# EAGLE design ace128_pcf8574_smd_v3 (EAGLE 9.2.2)
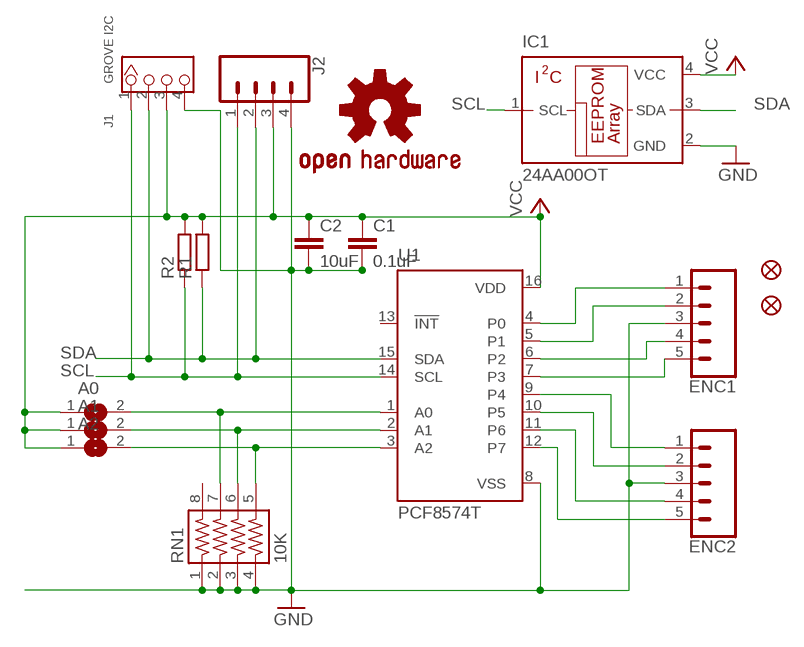
[diagram p0: schematic, sheet 1]

## Parts
A0  SJ  [SJ]
A1  SJ  [SJ]
A2  SJ  [SJ]
C1  0.1uF  C-EUC0603  [C0603]
C2  10uF  C-EUC0805  [C0805]
ENC1  CONN_05  [1X05]
ENC2  CONN_05  [1X05]
FD1  FIDUCIAL1X2  [FIDUCIAL-1X2]
FD2  FIDUCIAL1X2  [FIDUCIAL-1X2]
IC1  24AA00OT  [SOT23-5L]
J1  GROVE I2C  GROVE-CONNECTOR-DIP(4P-2.0)  [HW4-2.0]
J2  CONN_04  [1X04]
LOGO1  OSHW-LOGOS  [OSHW-LOGO-S]
R1  R-EU_0207/2V  [0207/2V]
R2  R-EU_0207/2V  [0207/2V]
RN1  10K  743-8  [743-8]
U1  PCF8574T  [SO16W]

## Nets
A0: A0.2 RN1.7 U1.1(A0)
A1: A1.2 RN1.6 U1.2(A1)
A2: A2.2 RN1.5 U1.3(A2)
GND: C1.2 C2.2 ENC1.3 ENC2.3 IC1.2(GND) J1.4 J2.4 RN1.1 RN1.2 RN1.3 RN1.4 U1.8(VSS)
P0: ENC1.1 U1.4(P0)
P1: ENC1.2 U1.5(P1)
P2: ENC1.4 U1.6(P2)
P3: ENC1.5 U1.7(P3)
P4: ENC2.1 U1.9(P4)
P5: ENC2.2 U1.10(P5)
P6: ENC2.4 U1.11(P6)
P7: ENC2.5 U1.12(P7)
SCL: IC1.1(SCL) J1.1 J2.1 R2.1 U1.14(SCL)
SDA: IC1.3(SDA) J1.2 J2.2 R1.1 U1.15(SDA)
VCC: A0.1 A1.1 A2.1 C1.1 C2.1 IC1.4(VCC) J1.3 J2.3 R1.2 R2.2 U1.16(VDD)
Unconnected: RN1.8 U1.13(!INT)

## Library data of the parts
A0 A1 A2 = jumper:SJ: SMD solder JUMPER
C1 C2 = rcl:C-EU: CAPACITOR, European symbol
ENC1 ENC2 = SparkFun-Connectors:CONN_05: Multi connection point. Often used as Generic Header-pin footprint for 0.1 inch spaced/style header connections On any of the 0.1 inch spaced packages, you can populate with these: Break Away Headers - Straight <https://www.sparkfun.com/products/116> (PRT-00116) Break Away Male Headers - Right Angle <https://www.sparkfun.com/products/553> (PRT-00553) Female Headers <https://www.sparkfun.com/products/115> (PRT-00115) Break Away Headers - Machine Pin <https://www.sparkfun.com/products/117> (PRT-00117) Break Away Female Headers - Swiss Machine Pin <https://www.sparkfun.com/products/743> (PRT-00743) For SCREWTERMINALS and SPRING TERMINALS visit here: Screw Terimnals on SparkFun.com <https://www.sparkfun.com/search/results?term=Screw+Terminals> (5mm/3.5mm/2.54mm spacing) This device is also useful as a general connection point to wire up your design to another part of your project. Our various solder wires solder well into these plated through hole pads. Hook-Up Wire - Assortment (Stranded, 22 AWG) <https://www.sparkfun.com/products/11375> (PRT-11375) Hook-Up Wire - Assortment (Solid Core, 22 AWG) <https://www.sparkfun.com/products/11367> (PRT-11367) View the entire wire category on our website here <https://www.sparkfun.com/categories/141> Special notes: Molex polarized connector foot print use with SKU : PRT-08231 with associated crimp pins and housings. 1MM SMD Version SKU: PRT-10208
FD1 FD2 = SparkFun-Aesthetics:FIDUCIAL: Fiducial Alignment Points Point-of-reference for pick-and-place machines and other optical instruments.
IC1 = microchip:24*00: Serial EEPROM 128 bit, I2C (AA = 1.8 V/LC = 2.5 V/C = 5.0 V); MF: MICROCHIP; MPN: 24AA00T-I/OTG; OC_FARNELL: 1331264; OC_NEWARK: 89H3038
J1 = Seeed-OPL-Connector:GROVE-CONNECTOR-DIP(4P-2.0): 320110033; VALUE: 4P-2.0
J2 = SparkFun-Connectors:CONN_04: Multi connection point. Often used as Generic Header-pin footprint for 0.1 inch spaced/style header connections On any of the 0.1 inch spaced packages, you can populate with these: Break Away Headers - Straight <https://www.sparkfun.com/products/116> (PRT-00116) Break Away Male Headers - Right Angle <https://www.sparkfun.com/products/553> (PRT-00553) Female Headers <https://www.sparkfun.com/products/115> (PRT-00115) Break Away Headers - Machine Pin <https://www.sparkfun.com/products/117> (PRT-00117) Break Away Female Headers - Swiss Machine Pin <https://www.sparkfun.com/products/743> (PRT-00743) For SCREWTERMINALS and SPRING TERMINALS visit here: Screw Terimnals on SparkFun.com <https://www.sparkfun.com/search/results?term=Screw+Terminals> (5mm/3.5mm/2.54mm spacing) This device is also useful as a general connection point to wire up your design to another part of your project. Our various solder wires solder well into these plated through hole pads. Hook-Up Wire - Assortment (Stranded, 22 AWG) <https://www.sparkfun.com/products/11375> (PRT-11375) Hook-Up Wire - Assortment (Solid Core, 22 AWG) <https://www.sparkfun.com/products/11367> (PRT-11367) View the entire wire category on our website here <https://www.sparkfun.com/categories/141> Special notes: Molex polarized connector foot print use with SKU : PRT-08231 with associated crimp pins and housings. 1MM SMD Version SKU: PRT-10208; PROD_ID: CONN-09696
LOGO1 = SparkFun-Aesthetics:OSHW-LOGO: Open-Source Hardware (OSHW) Logo This logo indicates the piece of hardware it is found on incorporates a OSHW license and/or adheres to the definition of open source hardware found here: http://freedomdefined.org/OSHW
R1 R2 = rcl:R-EU_: RESISTOR, European symbol
RN1 = resistor-array:743-8: CTS 743 Series 8 Terminations, 4 Resistors
U1 = micro-philips:PCF8574: I2C-Bus Remote 8-bit I/O expander http://www.semiconductors.philips.com/acrobat_download/datasheets/PCF8574_4.pdf; MPN: PCF8574T/3,512; OC_FARNELL: 1201255; OC_NEWARK: 70R6870

## Board
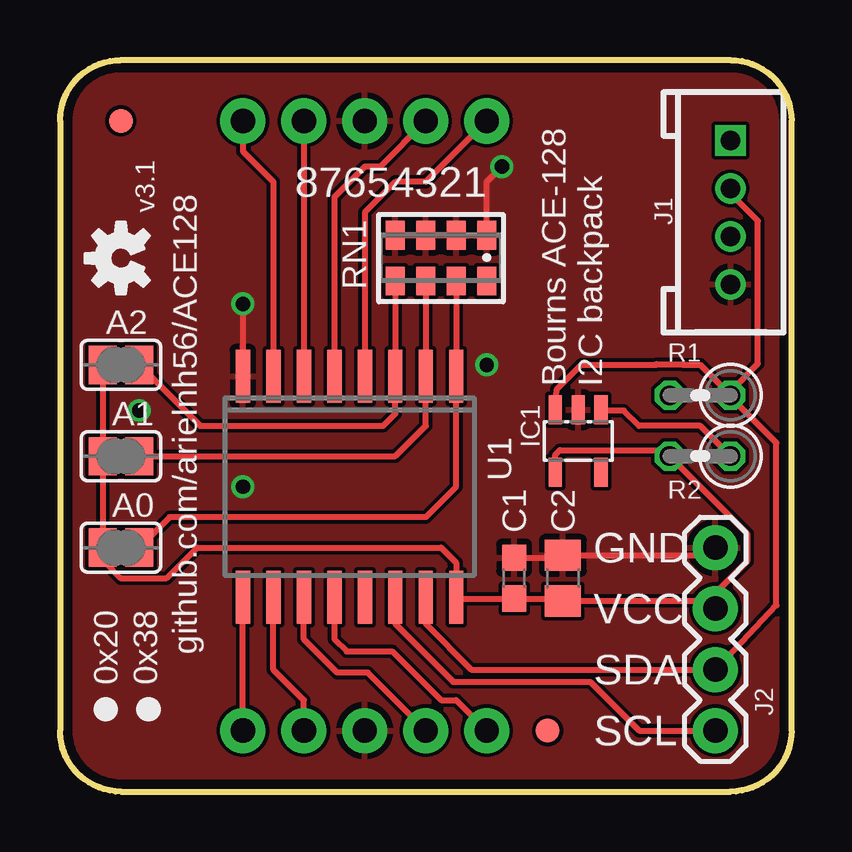
[diagram p1: board, top side]
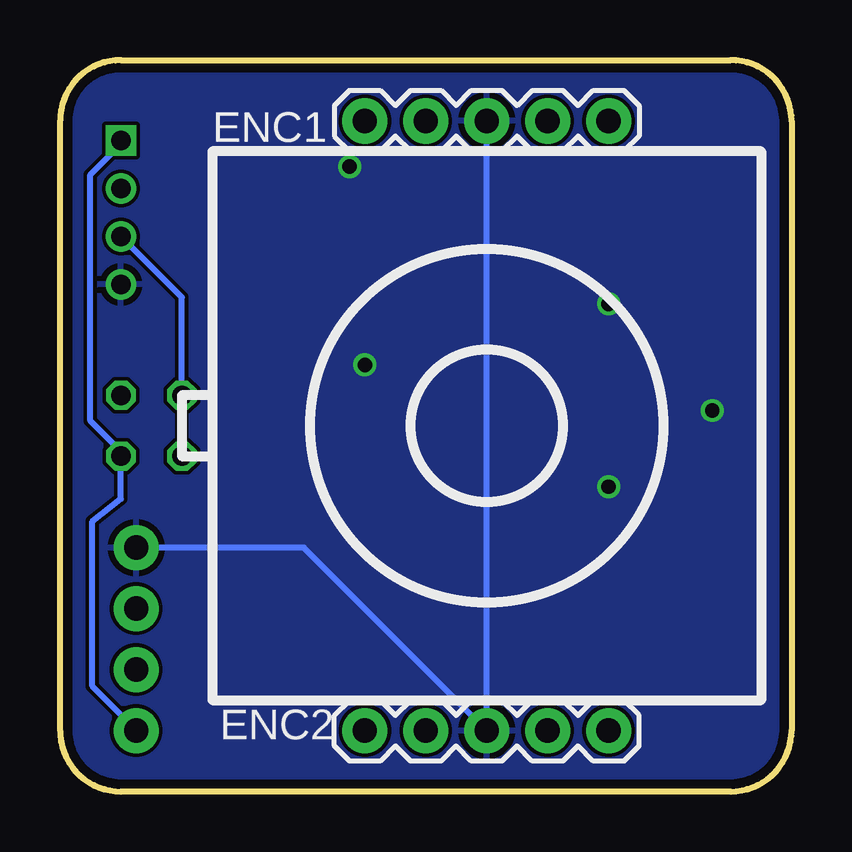
[diagram p2: board, bottom side, seen from below]

Size 30.48 x 30.48 mm. Coordinates in mm from the lower left corner, seen from the top.
Outline: 2.54,0 27.94,0 arc90 30.48,2.54 30.48,27.94 arc90 27.94,30.48 2.54,30.48 arc90 0,27.94 0,2.54 arc90 2.54,0
Copper layers (1*16): Top 0.0356mm / dielectric 1.5011mm / Bottom 0.0356mm
Design rules "mypcbway": minimum track width 6mil, minimum drill 13mil, track to track 6mil, track to pad 6mil, pad to pad 6mil, via to via 6mil, smd to smd 6mil, copper to edge 15mil, drill to drill 6mil, minimum pad ring 7mil, minimum via ring 7mil, stop-mask expansion 2.5mil, vias tented up to drill 24mil, thermal gap 10mil

### Footprints (pad centres in the part's own frame; a part is rotated, then mirrored left to right if it is on the bottom)
SJ = smd 1.168 x 1.6: 1 -0.762,0; 2 0.762,0
C0603 = smd 1.1 x 1: 1 -0.85,0; 2 0.85,0
C0805 = smd 1.3 x 1.5: 1 -0.95,0; 2 0.95,0
1X05 = drill 1.016 pad 1.88: 1 0,0; 2 2.54,0; 3 5.08,0; 4 7.62,0; 5 10.16,0
FIDUCIAL-1X2 = smd 1 x 1: 1 0,0
SOT23-5L = smd 0.55 x 1.2: 1 -0.95,-1.3; 2 0,-1.3; 3 0.95,-1.3; 4 0.95,1.3; 5 -0.95,1.3
HW4-2.0 = drill 0.8 pad 1.27 square: 1 -3,0 | drill 0.8 pad 1.27: 2 -1,0; 3 1,0; 4 3,0
1X04 = drill 1.016 pad 1.88: 1 0,0; 2 2.54,0; 3 5.08,0; 4 7.62,0
0207/2V = drill 0.813 octagon: 1 -1.27,0; 2 1.27,0
743-8 = smd 0.8 x 1.2: 1 -1.905,-0.953; 2 -0.635,-0.953; 3 0.635,-0.953; 4 1.905,-0.953; 5 1.905,0.953; 6 0.635,0.953; 7 -0.635,0.953; 8 -1.905,0.953
SO16W = smd 0.6 x 2.2: 1 -4.445,-4.6; 2 -3.175,-4.6; 3 -1.905,-4.6; 4 -0.635,-4.6; 5 0.635,-4.6; 6 1.905,-4.6; 7 3.175,-4.6; 8 4.445,-4.6; 9 4.445,4.6; 10 3.175,4.6; 11 1.905,4.6; 12 0.635,4.6; 13 -0.635,4.6; 14 -1.905,4.6; 15 -3.175,4.6; 16 -4.445,4.6

### Placement (x,y rotation side)
A0  2.54,10.16 0 top
A1  2.54,13.97 0 top
A2  2.54,17.78 0 top
C1  18.92,8.89 90 top
C2  20.95,8.89 90 top
ENC1  17.78,27.94 0 bottom
ENC2  7.62,2.54 180 bottom
FD1  2.54,27.94 0 top
FD2  20.32,2.54 0 top
IC1  21.59,14.61 180 top
J1  27.94,24.13 270 top
J2  27.3,2.54 90 top
LOGO1  2.54,22.23 90 top
R1  26.67,16.51 180 top
R2  26.67,13.97 180 top
RN1  15.88,22.23 180 top
U1  12.06,12.7 180 top

### Tracks (layer width: path | path; a pad name or v marks a point on that pad's centre or on a via)
A0
  Top 0.254: RN1.7 U1.1 16.51,12.7 15.24,11.43 4.57,11.43 A0.2
A1
  Top 0.254: RN1.6 U1.2 15.24,15.24 13.97,13.97 A1.2
A2
  Top 0.254: RN1.5 U1.3 13.97,15.75 13.46,15.24 5.84,15.24 A2.2
GND  (via drill 0.6)
  Top 0.254: RN1.4 RN1.3 RN1.2 RN1.1 17.78,25.4 v18.41,26.04 | v7.62,20.32 U1.8 | C1.2 20.86,9.74 C2.2 26.98,9.84 J2.4
  Bottom 0.254: ENC1.3 ENC2.3 20.32,10.16 J2.4
  other vias: 7.62,12.7 17.78,17.78 3.3,15.88
  pour Top: 0,30.48 0,0 30.48,0 30.48,30.48
  pour Bottom: 0,30.48 30.48,30.48 30.48,0 0,0
P0
  Top 0.254: ENC1.1 15.24,25.4 13.97,25.4 12.7,24.13 U1.4
P1
  Top 0.254: ENC1.2 13.34,26.04 12.7,26.04 11.43,24.77 U1.5
P2
  Top 0.254: ENC1.4 U1.6
P3
  Top 0.254: ENC1.5 7.62,26.67 8.89,25.4 U1.7
P4
  Top 0.254: ENC2.1 U1.9
P5
  Top 0.254: ENC2.2 10.16,3.81 8.89,5.08 U1.10
P6
  Top 0.254: ENC2.4 12.83,4.95 11.56,4.95 10.16,6.35 U1.11
P7
  Top 0.254: U1.12 11.43,6.35 11.94,5.84 13.84,5.84 15.88,3.81 16.51,3.81 ENC2.5
SCL
  Top 0.254: U1.14 13.97,6.99 16.38,4.57 22.1,4.57 24.13,2.54 J2.1 | R2.1 26.67,15.24 24.13,15.24 23.5,15.88 22.57,15.88 IC1.1
  Bottom 0.254: J1.1 27.94,26.98 29.21,25.7 29.21,15.44 27.94,14.17 R2.1 27.94,12.19 29.13,11.25 29.13,4.39 27.48,2.74 J2.1
SDA
  Top 0.254: J1.2 27.94,24.92 29.08,23.77 29.08,17.83 27.94,16.69 R1.1 | R1.1 27.94,16.43 29.84,14.53 29.84,7.75 27.81,5.59 J2.2 17.14,5.08 15.24,6.99 U1.15 | IC1.3 20.7,16.76 21.72,17.78 24.84,17.78 24.86,17.8 25.94,17.8 25.96,17.78 26.67,17.78 R1.1
VCC
  Top 0.254: A2.1 A1.1 A0.1 1.91,10.03 1.91,9.53 2.54,8.89 4.45,8.89 5.71,10.16 15.88,10.16 16.51,9.53 U1.16 16.67,7.94 16.77,8.04 C1.1 20.86,8.04 C2.1 26.98,7.94 J2.3 27.48,7.77 27.48,8.46 28.63,9.6 28.63,10.74 R2.2 25.15,14.22 20.83,14.22 20.64,14.04 IC1.4
  Bottom 0.254: J1.3 25.4,20.59 R1.2 R2.2

### Text on the board
tPlace: 87654321 | v3.1 | Bourns ACE-128 / I2C backpack | GND | VCC | github.com/arielnh56/ACE128 | 0x20 | 0x38 | SDA | SCL